# EAGLE schematic MA_board_2 (EAGLE 9.4.2)
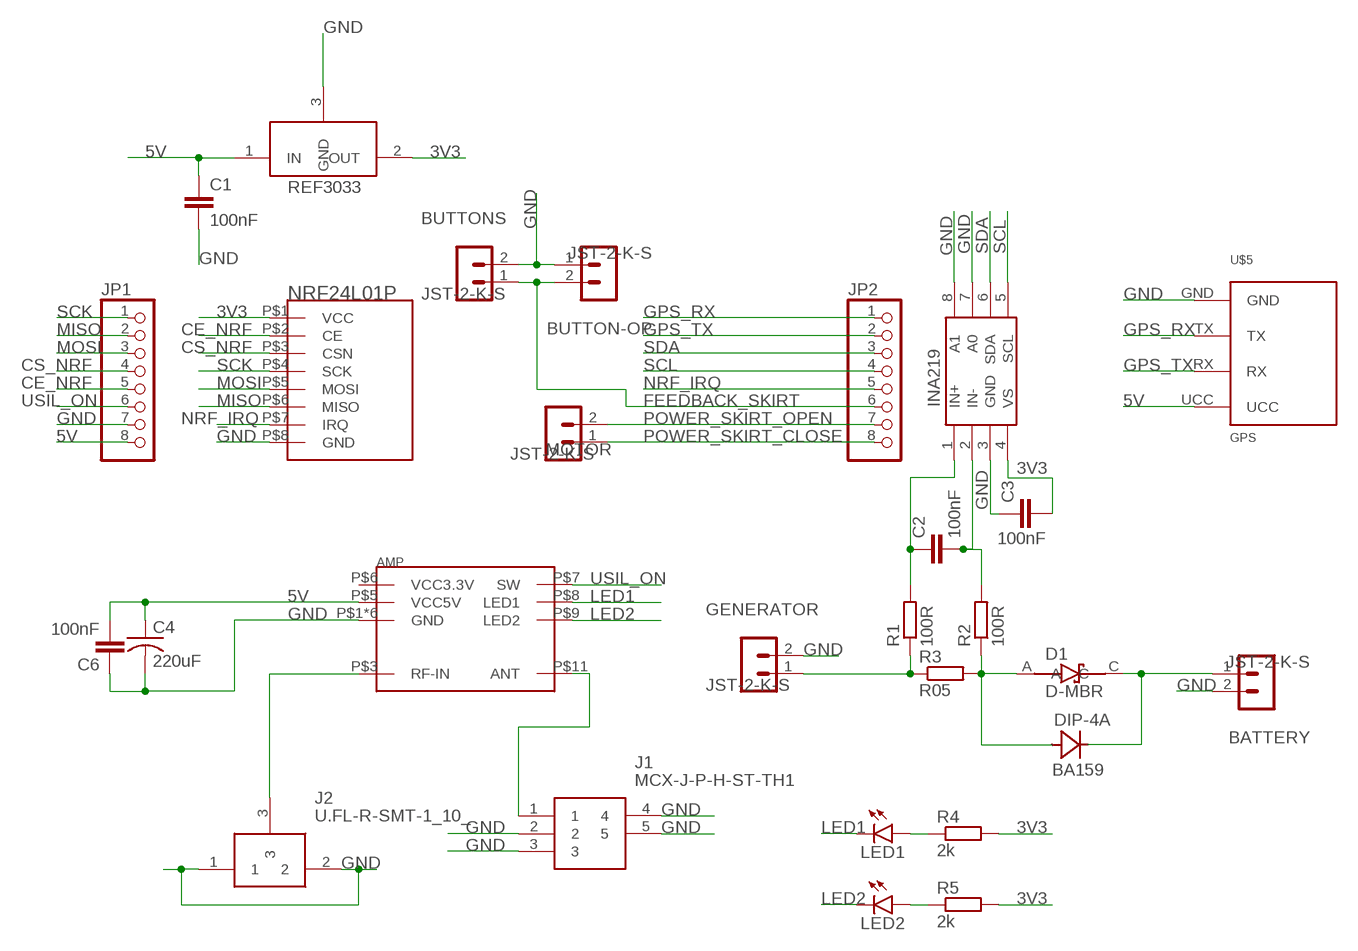
[diagram p0: schematic, sheet 1]

## Parts
AMP  XQ-02A  [XQ-02A]
BATTERY  JST-2-K-S  [B2B-PH-K-S]
BUTTON-OP  JST-2-K-S  [B2B-PH-K-S]
BUTTONS  JST-2-K-S  [B2B-PH-K-S]
C1  100nF  C-EUC0603  [C0603]
C2  100nF  C-EUC0603  [C0603]
C3  100nF  C-EUC0603  [C0603]
C4  220uF  ECAPECAP220  [ECAP220-CMD]
C6  100nF  C-EUC0603  [C0603]
D1  D-MBR  DIODE-MBR  [SOD123]
DIP-4A  BA159  [BA159]
GENERATOR  JST-2-K-S  [B2B-PH-K-S]
INA219  INA219AID  [SOT23-8]
J1  MCX-J-P-H-ST-TH1  [MCXJPHSTTH1]
J2  U.FL-R-SMT-1_10_  [U.FL-R-SMT-1(10)]
JP1  PINHD-1X8-SHORT-PAD  [1X08]
JP2  PINHD-1X8-SHORT-PAD  [1X08]
LED1  LEDSML0603  [SML0603]
LED2  LEDSML0603  [SML0603]
MOTOR  JST-2-K-S  [B2B-PH-K-S]
NRF24L01P  NRF24L01_ML01SP4  [NRF24L01_ML01SP4]
R1  100R  R-EU_R0603  [R0603]
R2  100R  R-EU_R0603  [R0603]
R3  R05  R-EU_R2512  [R2512]
R4  2k  R-EU_R0603  [R0603]
R5  2k  R-EU_R0603  [R0603]
REF3033  REF3033  [SOT23-3]
U$5  GPS  [GPS]

## Nets
3V3: C3.2 INA219.4(VS) NRF24L01P.P$1(VCC) R4.2 R5.2 REF3033.2(OUT)
5V: AMP.P$5(VCC5V) C1.1 C4.P$1 C6.2 JP1.8 REF3033.1(IN) U$5.UCC
CE_NRF: JP1.5 NRF24L01P.P$2(CE)
CS_NRF: JP1.4 NRF24L01P.P$3(CSN)
FEEDBACK_SKIRT: BUTTON-OP.2 BUTTONS.1 JP2.6
GND: AMP.P$1(GND) AMP.P$2(GND) AMP.P$4(GND) AMP.P$10(GND) AMP.P$12(GND) AMP.P$13(GND) BATTERY.2 BUTTON-OP.1 BUTTONS.2 C1.2 C3.1 C4.P$2 C6.1 GENERATOR.2 INA219.3(GND) INA219.7(A0) INA219.8(A1) J1.2 J1.3 J1.4 J1.5 J2.1 J2.2 JP1.7 NRF24L01P.P$8(GND) REF3033.3(GND) U$5.GND
GPS_RX: JP2.1 U$5.TX
GPS_TX: JP2.2 U$5.RX
LED1: AMP.P$8(LED1) LED1.C
LED2: AMP.P$9(LED2) LED2.C
MISO: JP1.2 NRF24L01P.P$6(MISO)
MOSI: JP1.3 NRF24L01P.P$5(MOSI)
N$1: C2.1 INA219.1(IN+) R1.2
N$2: AMP.P$3(RF-IN) J2.3
N$3: AMP.P$11(ANT) J1.1
N$4: GENERATOR.1 R1.1 R3.1
N$5: C2.2 INA219.2(IN-) R2.2
N$6: BATTERY.1 D1.C DIP-4A.P$2(C)
N$7: LED1.A R4.1
N$8: D1.A DIP-4A.P$1(A) R2.1 R3.2
N$9: LED2.A R5.1
NRF_IRQ: JP2.5 NRF24L01P.P$7(IRQ)
POWER_SKIRT_CLOSE: JP2.8 MOTOR.1
POWER_SKIRT_OPEN: JP2.7 MOTOR.2
SCK: JP1.1 NRF24L01P.P$4(SCK)
SCL: INA219.5(SCL) JP2.4
SDA: INA219.6(SDA) JP2.3
USIL_ON: AMP.P$7(SW) JP1.6
Unconnected: AMP.P$6(VCC3.3V)

## Library data of the parts
AMP = NEON-BLADE-2023:XQ-02A
BATTERY BUTTON-OP BUTTONS GENERATOR MOTOR = NEON-BLADE-2023:JST-2: JST PH series header 2.00mm pitch disconnectable crimp style connectors, vertical (side entry type), 2 pins
C1-C3 C6 = rcl:C-EU: CAPACITOR, European symbol; SPICEPREFIX: C
C4 = NEON-BLADE-2023:ECAP
D1 = NEON-BLADE-2023:DIODE-MBR: Rectifier, Schottky Power; Plastic Sod-123; 0.5 a @ +90c If; +125; 20v; 1000 Check prices <https://pricing.snapeda.com/parts/MBR0520LT1G/ON%20Semiconductor/view-part?ref=eda>; AVAILABILITY: Good; DESCRIPTION: Diode Schottky 20V 500mA Surface Mount SOD-123; MF: ON Semiconductor; MP: MBR0520LT1G; PACKAGE: SOD-123-2 ON Semiconductor; PRICE: None; PURCHASE-URL: https://pricing.snapeda.com/search/part/MBR0520LT1G/?ref=eda
DIP-4A = NEON-BLADE-2023:BA159
INA219 = NEON-BLADE-2023:INA219AID
J1 = MCX-J-P-H-ST-TH1:MCX-J-P-H-ST-TH1: Samtec MCXSeries, Through Hole MCX Jack jack, 50 Impedance, Solder Termination, 0 6GHz, Coaxial cable type Source: Datasheet <http://suddendocs.samtec.com/prints/mcx-j-p-x-st-th1-mkt.pdf>; ARROW_PART_NUMBER: MCX-J-P-H-ST-TH1; ARROW_PRICE-STOCK: https://www.arrow.com/en/products/mcx-j-p-h-st-th1/samtec?region=nac; DESCRIPTION: Samtec MCXSeries, Through Hole MCX Jack jack, 50 Impedance, Solder Termination, 0 6GHz, Coaxial cable type; HEIGHT: 5.81mm; MANUFACTURER_NAME: SAMTEC; MANUFACTURER_PART_NUMBER: MCX-J-P-H-ST-TH1; MOUSER_PART_NUMBER: 200-MCXJPHSTTH1; MOUSER_PRICE-STOCK: https://www.mouser.co.uk/ProductDetail/Samtec/MCX-J-P-H-ST-TH1?qs=Cqqh%252BS766wnNti0C6DXzpQ%3D%3D
J2 = U.FL-R-SMT-1_10_:U.FL-R-SMT-1_10_: UFL SMT PCB receptable,DC-6GHz Hirose Straight 50 Surface Mount UFL Connector, Receptacle, Solder Termination Coaxial Source: Datasheet <https://www.hirose.com/product/document?clcode=CL0331-0472-2-10&productname=U.FL-R-SMT-1(10)&series=U.FL&documenttype=2DDrawing&lang=en&documentid=0000940684>; ARROW_PART_NUMBER: U.FL-R-SMT-1(10); ARROW_PRICE-STOCK: https://www.arrow.com/en/products/u.fl-r-smt-1-10/hirose-electric; DESCRIPTION: UFL SMT PCB receptable,DC-6GHz Hirose Straight 50 Surface Mount UFL Connector, Receptacle, Solder Termination Coaxial; HEIGHT: mm; MANUFACTURER_NAME: Hirose; MANUFACTURER_PART_NUMBER: U.FL-R-SMT-1(10); MOUSER_PART_NUMBER: 798-U.FL-R-SMT-110; MOUSER_PRICE-STOCK: https://www.mouser.co.uk/ProductDetail/Hirose-Connector/U.FL-R-SMT-110?qs=kL1ClTr6oBoOdtqlGQpQrQ%3D%3D
JP1 JP2 = NEON-BLADE-2023:PINHD-1X8-SHORT-PAD: PIN HEADER
LED1 LED2 = led:LED: LED OSRAM: - CHIPLED LG R971, LG N971, LY N971, LG Q971, LY Q971, LO R971, LY R971 LH N974, LH R974 LS Q976, LO Q976, LY Q976 LO Q996 - Hyper CHIPLED LW Q18S LB Q993, LB Q99A, LB R99A - SideLED LS A670, LO A670, LY A670, LG A670, LP A670 LB A673, LV A673, LT A673, LW A673 LH A674 LY A675 LS A676, LA A676, LO A676, LY A676, LW A676 LS A679, LY A679, LG A679 - Hyper Micro SIDELED® LS Y876, LA Y876, LO Y876, LY Y876 LT Y87S - SmartLED LW L88C, LW L88S LB L89C, LB L89S, LG L890 LS L89K, LO L89K, LY L89K LS L896, LA L896, LO L896, LY L896 - TOPLED LS T670, LO T670, LY T670, LG T670, LP T670 LSG T670, LSP T670, LSY T670, LOP T670, LYG T670 LG T671, LOG T671, LSG T671 LB T673, LV T673, LT T673, LW T673 LH T674 LS T676, LA T676, LO T676, LY T676, LB T676, LH T676, LSB T676, LW T676 LB T67C, LV T67C, LT T67C, LS T67K, LO T67K, LY T67K, LW E67C LS E67B, LA E67B, LO E67B, LY E67B, LB E67C, LV E67C, LT E67C LW T67C LS T679, LY T679, LG T679 LS T770, LO T770, LY T770, LG T770, LP T770 LB T773, LV T773, LT T773, LW T773 LH T774 LS E675, LA E675, LY E675, LS T675 LS T776, LA T776, LO T776, LY T776, LB T776 LHGB T686 LT T68C, LB T68C - Hyper Mini TOPLED® LB M676 - Mini TOPLED Santana® LG M470 LS M47K, LO M47K, LY M47K Source: http://www.osram.convergy.de LUXEON: - LUMILED® LXK2-PW12-R00, LXK2-PW12-S00, LXK2-PW14-U00, LXK2-PW14-V00 LXK2-PM12-R00, LXK2-PM12-S00, LXK2-PM14-U00 LXK2-PE12-Q00, LXK2-PE12-R00, LXK2-PE12-S00, LXK2-PE14-T00, LXK2-PE14-U00 LXK2-PB12-K00, LXK2-PB12-L00, LXK2-PB12-M00, LXK2-PB14-N00, LXK2-PB14-P00, LXK2-PB14-Q00 LXK2-PR12-L00, LXK2-PR12-M00, LXK2-PR14-Q00, LXK2-PR14-R00 LXK2-PD12-Q00, LXK2-PD12-R00, LXK2-PD12-S00 LXK2-PH12-R00, LXK2-PH12-S00 LXK2-PL12-P00, LXK2-PL12-Q00, LXK2-PL12-R00 Source: www.luxeon.com KINGBRIGHT: KA-3528ASYC Source: www.kingbright.com
NRF24L01P = NEON-BLADE-2023:NRF24L01_ML01SP4
R1-R5 = rcl:R-EU_: RESISTOR, European symbol; SPICEPREFIX: R
REF3033 = NEON-BLADE-2023:REF3033
U$5 = cansat-lib:GPS